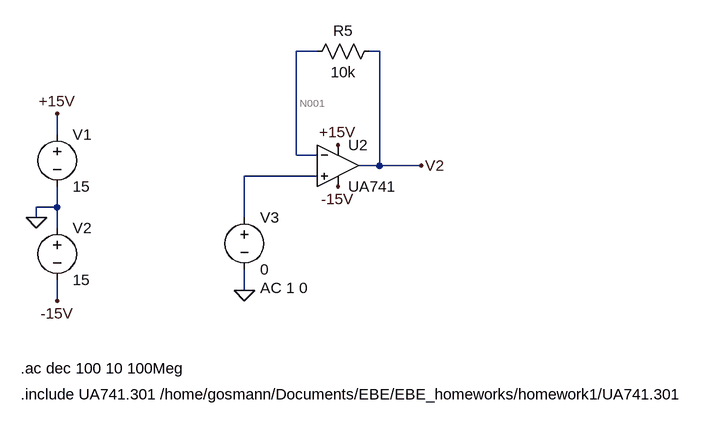
[diagram p0: schematic sim_ex1.asc]
sim_ex1.asc, the LTspice schematic file:
Version 4
SHEET 1 880 680
WIRE 144 -144 112 -144
WIRE 240 -144 224 -144
WIRE -256 -16 -256 -48
WIRE 112 16 112 -144
WIRE 144 16 112 16
WIRE 240 32 240 -144
WIRE 240 32 208 32
WIRE 304 32 240 32
WIRE 144 48 32 48
WIRE -256 96 -256 64
WIRE -256 96 -288 96
WIRE -288 112 -288 96
WIRE 32 112 32 48
WIRE -256 128 -256 96
WIRE 32 224 32 192
WIRE -256 240 -256 208
FLAG -288 112 0
FLAG -256 -48 +15V
FLAG -256 240 -15V
FLAG 176 0 +15V
FLAG 176 64 -15V
FLAG 32 224 0
FLAG 304 32 V2
SYMBOL voltage -256 -32 R0
WINDOW 123 0 0 Left 0
WINDOW 39 0 0 Left 0
SYMATTR InstName V1
SYMATTR Value 15
SYMBOL voltage -256 112 R0
WINDOW 123 0 0 Left 0
WINDOW 39 0 0 Left 0
SYMATTR InstName V2
SYMATTR Value 15
SYMBOL res 240 -160 R90
WINDOW 0 0 56 VBottom 2
WINDOW 3 32 56 VTop 2
SYMATTR InstName R5
SYMATTR Value 10k
SYMBOL voltage 32 96 R0
WINDOW 123 24 124 Left 2
WINDOW 39 0 0 Left 0
SYMATTR InstName V3
SYMATTR Value 0
SYMATTR Value2 AC 1 0
SYMBOL OpAmps\\opamp2 176 -32 R0
SYMATTR InstName U2
SYMATTR Value UA741
TEXT -312 344 Left 2 !.ac dec 100 10 100Meg
TEXT -312 384 Left 2 !.include UA741.301 /home/gosmann/Documents/EBE/EBE_homeworks/homework1/UA741.301

The netlist it stands for:
* sim_ex1.asc
V1 +15V 0 15
V2 0 -15V 15
R5 V2 N001 10k
V3 N002 0 0 AC 1 0
XU2 N002 N001 +15V -15V V2 UA741  ; pins In+ In- V+ V- OUT
.ac dec 100 10 100Meg
.include UA741.301 /home/gosmann/Documents/EBE/EBE_homeworks/homework1/UA741.301
.backanno
.end

* Results of the author's LTspice run, read from the files saved beside the schematic
* Operating Point, zero values left out:
*   V(+15v) = 15 V
*   V(-15v) = -15 V
*   V(v2) = 808.8 µV
*   V(n001) = 11.18 µV
*   I(R5) = 79.76 nA
*   I(V3) = -79.74 nA
*   I(V2) = -1.667 mA
*   I(V1) = -1.667 mA
*   Ix(u2:1) = 79.74 nA
*   Ix(u2:2) = 79.76 nA
*   Ix(u2:3) = 1.667 mA
*   Ix(u2:4) = -1.667 mA
*   Ix(u2:5) = -79.76 nA
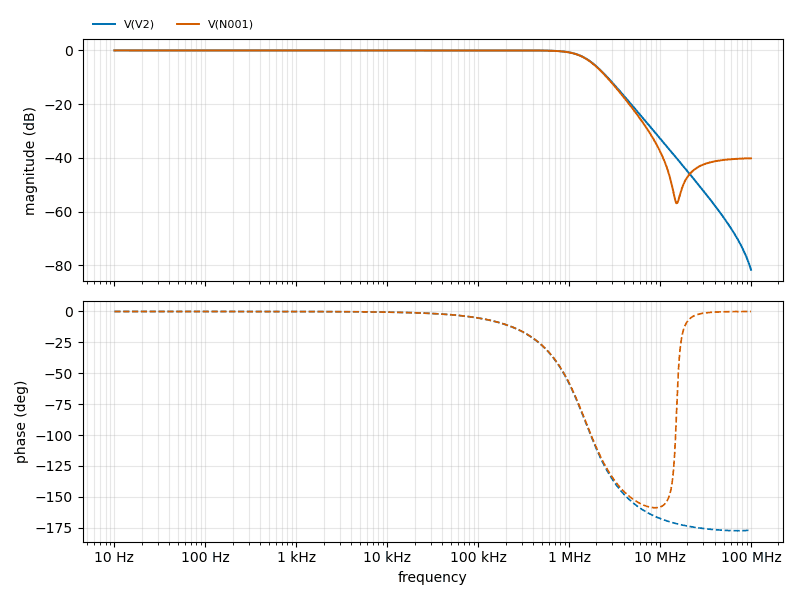
[diagram p1: AC Analysis of sim_ex1.asc, plotted from the saved traces]
* AC Analysis, 1 run:
*   V(V2): -0.00 dB at 10 Hz, -81.60 dB at 100 MHz, peak 0.00 dB at 147.9 kHz, 3 dB below the peak at 1.53 MHz
*   V(N001): -0.00 dB at 10 Hz, -40.13 dB at 100 MHz, peak -0.00 dB at 10 Hz, 3 dB below the peak at 1.516 MHz